# EAGLE design M405B (EAGLE 6.6.0)
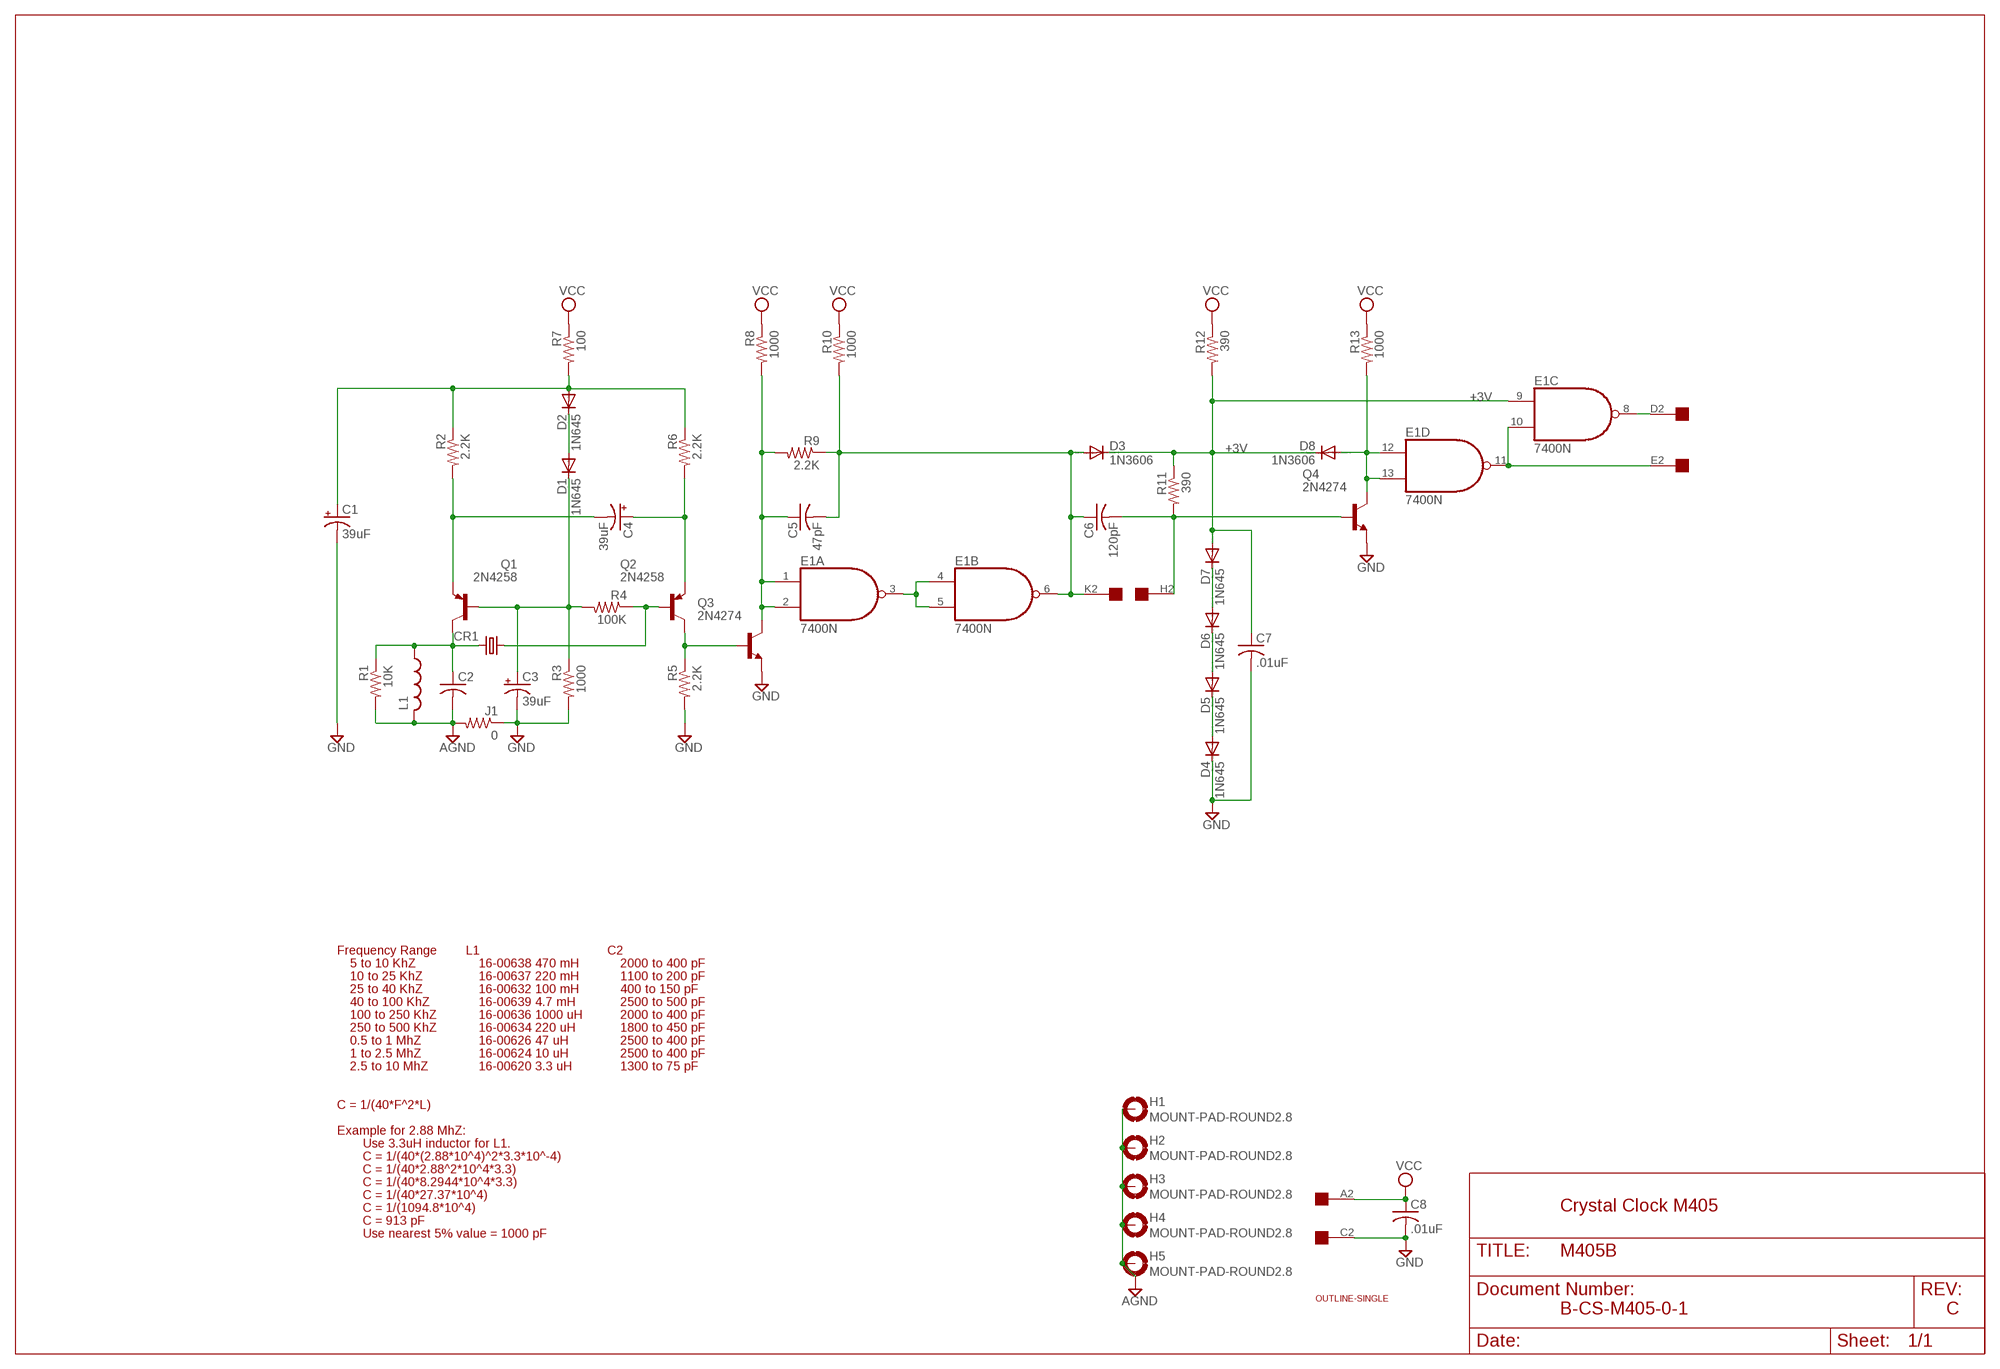
[diagram p0: schematic, sheet 1]

## Parts
C1  39uF  CPOL-USE15-5AXIAL  [E15-5]
C2  C-US150-054X183  [C150-054X183]
C3  39uF  CPOL-USE15-5AXIAL  [E15-5]
C4  39uF  CPOL-USE15-5AXIAL  [E15-5]
C5  47pF  C-US050-025X075  [C050-025X075]
C6  120pF  C-US050-025X075  [C050-025X075]
C7  .01uF  C-US050-025X075  [C050-025X075]
C8  .01uF  C-US050-025X075  [C050-025X075]
CR1  CRYSTALHC13U-H  [HC13U-H]
D1  1N645  1N4148DO35-10  [DO35-10]
D2  1N645  1N4148DO35-10  [DO35-10]
D3  1N3606  1N4148DO35-10  [DO35-10]
D4  1N645  1N4148DO35-10  [DO35-10]
D5  1N645  1N4148DO35-10  [DO35-10]
D6  1N645  1N4148DO35-10  [DO35-10]
D7  1N645  1N4148DO35-10  [DO35-10]
D8  1N3606  1N4148DO35-10  [DO35-10]
E1  7400N  [DIL14]
H1  MOUNT-PAD-ROUND2.8  [2,8-PAD]
H2  MOUNT-PAD-ROUND2.8  [2,8-PAD]
H3  MOUNT-PAD-ROUND2.8  [2,8-PAD]
H4  MOUNT-PAD-ROUND2.8  [2,8-PAD]
H5  MOUNT-PAD-ROUND2.8  [2,8-PAD]
J1  0  R-US_0207/10  [0207/10]
L1  L-US0207/12  [0207/12]
Q1  2N4258  2N3637-PNP-TO39-EBC  [TO39]
Q2  2N4258  2N3637-PNP-TO39-EBC  [TO39]
Q3  2N4274  2N3019-NPN-TO39-EBC  [TO39]
Q4  2N4274  2N3019-NPN-TO39-EBC  [TO39]
R1  10K  R-US_0207/10  [0207/10]
R2  2.2K  R-US_0207/10  [0207/10]
R3  1000  R-US_0207/10  [0207/10]
R4  100K  R-US_0207/10  [0207/10]
R5  2.2K  R-US_0207/10  [0207/10]
R6  2.2K  R-US_0207/10  [0207/10]
R7  100  R-US_0207/10  [0207/10]
R8  1000  R-US_0207/10  [0207/10]
R9  2.2K  R-US_0207/10  [0207/10]
R10  1000  R-US_0207/10  [0207/10]
R11  390  R-US_0207/10  [0207/10]
R12  390  R-US_0207/10  [0207/10]
R13  1000  R-US_0207/10  [0207/10]
U$1  OUTLINE-SINGLE  [SINGLE]
U$2  EDGE-1  [EDGE-CON1]

## Nets
+3V: C7.1 D3.C D7.A D8.C E1.9(C:I0) R11.1 R12.2
AGND [power]: C2.2 H1.B2,8(MOUNT) H2.B2,8(MOUNT) H3.B2,8(MOUNT) H4.B2,8(MOUNT) H5.B2,8(MOUNT) J1.2 L1.2 R1.2
GND [power]: C1.- C3.- C7.2 C8.2 D4.C J1.1 Q3.1(E) Q4.1(E) R3.2 R5.2 U$2.C2
N$1: CR1.1 Q2.2(B) R4.1
N$2: C4.- Q1.1(E) R2.2
N$3: C3.+ D1.C Q1.2(B) R3.1 R4.2
N$4: E1.8(C:O) U$2.D2
N$5: C2.1 CR1.2 L1.1 Q1.3(C) R1.1
N$6: D1.A D2.C
N$7: E1.10(C:I1) E1.11(D:O) U$2.E2
N$8: C4.+ Q2.1(E) R6.2
N$9 [power]: C1.+ D2.A R2.1 R6.1 R7.2
N$10: Q2.3(C) Q3.2(B) R5.1
N$11: C5.1 E1.1(A:I0) E1.2(A:I1) Q3.3(C) R8.2 R9.2
N$12: D8.A E1.12(D:I0) E1.13(D:I1) Q4.3(C) R13.2
N$13: C5.2 C6.1 D3.A E1.6(B:O) R9.1 R10.2 U$2.K2
N$14: E1.3(A:O) E1.4(B:I0) E1.5(B:I1)
N$15: D6.A D7.C
N$16: C6.2 Q4.2(B) R11.2 U$2.H2
N$18: D5.A D6.C
N$19: D4.A D5.C
VCC [power]: C8.1 R7.1 R8.1 R10.1 R12.1 R13.1 U$2.A2
Unconnected: U$2.B2 U$2.F2 U$2.J2 U$2.L2 U$2.M2 U$2.N2 U$2.P2 U$2.R2 U$2.S2 U$2.T2 U$2.U2 U$2.V2

## Notes on the sheet
- Frequency Range | L1 | C2
- 5 to 10 KhZ | 16-00638 470 mH | 2000 to 400 pF
- 10 to 25 KhZ | 16-00637 220 mH | 1100 to 200 pF
- 25 to 40 KhZ | 16-00632 100 mH | 400 to 150 pF
- 40 to 100 KhZ | 16-00639 4.7 mH | 2500 to 500 pF
- 100 to 250 KhZ | 16-00636 1000 uH | 2000 to 400 pF
- 250 to 500 KhZ | 16-00634 220 uH | 1800 to 450 pF
- 0.5 to 1 MhZ | 16-00626 47 uH | 2500 to 400 pF
- 1 to 2.5 MhZ | 16-00624 10 uH | 2500 to 400 pF
- 2.5 to 10 MhZ | 16-00620 3.3 uH | 1300 to 75 pF
- C = 1/(40*F^2*L)
- Example for 2.88 MhZ:
- Use 3.3uH inductor for L1.
- C = 1/(40*(2.88*10^4)^2*3.3*10^-4)
- C = 1/(40*2.88^2*10^4*3.3)
- C = 1/(40*8.2944*10^4*3.3)
- C = 1/(40*27.37*10^4)
- C = 1/(1094.8*10^4) | Crystal Clock M405
- C = 913 pF
- Use nearest 5% value = 1000 pF
- B-CS-M405-0-1 | C

## Power pins joined to a net without a drawn wire
GND: E1.7(P:GND)
VCC: E1.14(P:VCC)

## Library data of the parts
C1 C3 C4 = rcl:CPOL-US: POLARIZED CAPACITOR, American symbol
C2 C5-C8 = rcl:C-US: CAPACITOR, American symbol
CR1 = crystal:CRYSTAL: CRYSTAL; OC_FARNELL: unknown; OC_NEWARK: unknown
D1-D8 = diode:1N4148: DIODE high speed (Philips)
E1 = 74xx-us:74*00: Quad 2-input NAND gate
H1-H5 = holes:MOUNT-PAD-ROUND: MOUNTING PAD, round
J1 R1-R13 = rcl:R-US_: RESISTOR, American symbol
L1 = rcl:L-US: INDUCTOR, American symbol
Q1 Q2 = transistor:*-PNP-: PNP Transistror
Q3 Q4 = transistor:*-NPN-: NPN Transistror BF959 corrected 2008.03.06
U$1 = dec-con:OUTLINE-*: Board outlines for DEC boards.
U$2 = dec-con:EDGE-1: Single-Sided DEC Edge Connector -- (side 2)

## Net classes
1 power: width 0.813 mm

## Board
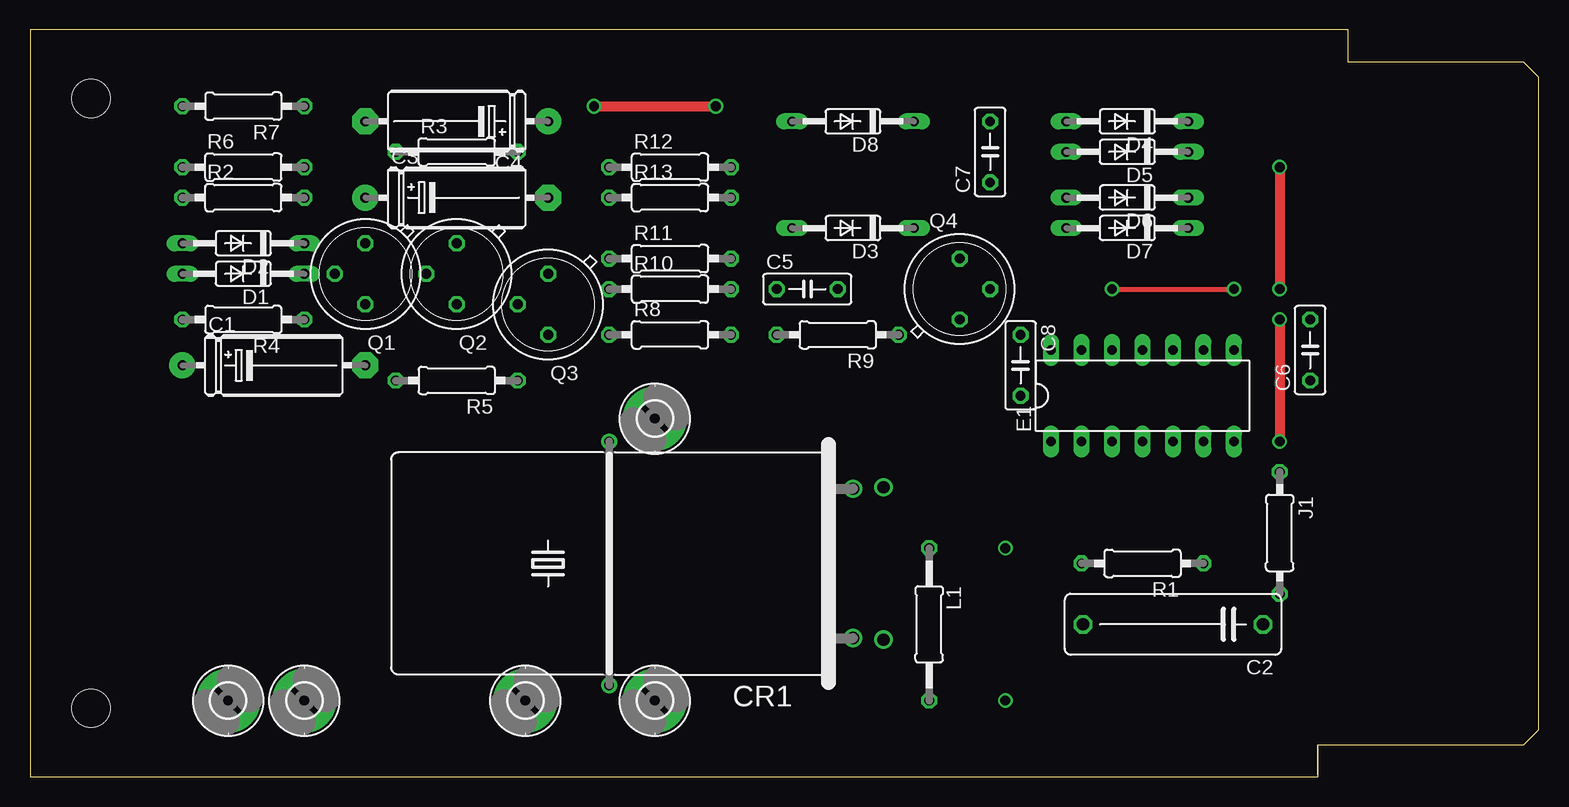
[diagram p1: board, top side]
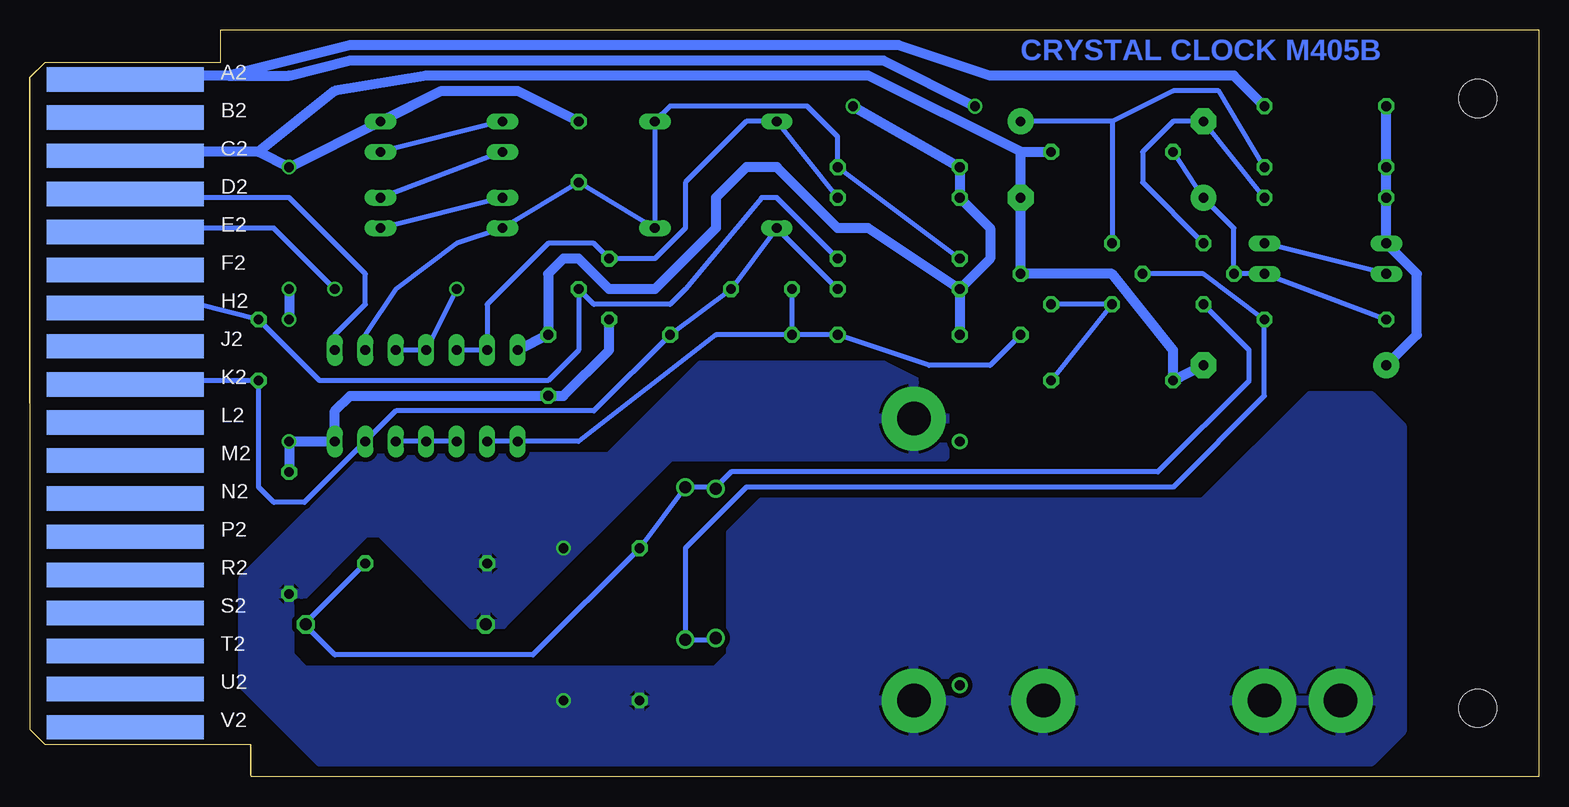
[diagram p2: board, bottom side, seen from below]

Size 125.73 x 62.23 mm. Coordinates in mm from the lower left corner, seen from the top.
Copper layers (1+16): Top 0.035mm / dielectric 1.5mm / Bottom 0.035mm
Design rules "16mils": minimum track width 16mil, minimum drill 32mil, track to track 15mil, track to pad 10mil, pad to pad 10mil, via to via 10mil, smd to smd 10mil, copper to edge 13mil, drill to drill 10mil, minimum pad ring 10mil, minimum via ring 8mil, stop-mask expansion 0mil, vias tented up to drill 0mil, thermal gap 10mil

### Footprints (pad centres in the part's own frame; a part is rotated, then mirrored left to right if it is on the bottom)
E15-5 = drill 0.813 pad 2.159: + -7.62,0 | drill 0.813 pad 2.159 octagon: - 7.62,0
C150-054X183 = drill 1.016 octagon: 1 -7.493,0; 2 7.493,0
C050-025X075 = drill 0.813 octagon: 1 -2.54,0; 2 2.54,0
HC13U-H = drill 1.016: 1 -6.223,-5.08; 2 6.223,-5.08 | drill 0.813: M -10.16,15.24; M1 10.16,15.24
DO35-10 = drill 0.813 long: A 5.08,0; C -5.08,0
DIL14 = drill 0.813 long: 1 -7.62,-3.81; 2 -5.08,-3.81; 3 -2.54,-3.81; 4 0,-3.81; 5 2.54,-3.81; 6 5.08,-3.81; 7 7.62,-3.81; 8 7.62,3.81; 9 5.08,3.81; 10 2.54,3.81; 11 0,3.81; 12 -2.54,3.81; 13 -5.08,3.81; 14 -7.62,3.81
2,8-PAD = drill 2.8 pad 5.334: B2,8 0,0
0207/10 = drill 0.813 octagon: 1 -5.08,0; 2 5.08,0
0207/12 = drill 0.813 octagon: 1 -6.35,0; 2 6.35,0
TO39 = drill 0.813 octagon: 1 0,-2.54; 2 2.54,0; 3 0,2.54
SINGLE = hole 3.175: 120.65,56.515; 120.65,5.715
EDGE-CON1 = smd 13.106 x 2.032 bottom: A2 7.938,4.128; B2 7.938,7.303; C2 7.938,10.477; D2 7.938,13.652; E2 7.938,16.828; F2 7.938,20.003; H2 7.938,23.177; J2 7.938,26.352; K2 7.938,29.527; L2 7.938,32.703; M2 7.938,35.877; N2 7.938,39.053; P2 7.938,42.227; R2 7.938,45.403; S2 7.938,48.578; T2 7.938,51.752; U2 7.938,54.928; V2 7.938,58.102

### Placement (x,y rotation side)
C1  20.32,34.29 0 top
C2  95.25,12.7 180 top
C3  35.56,48.26 0 top
C4  35.56,54.61 180 top
C5  64.77,40.64 0 top
C6  106.68,35.56 90 top
C7  80.01,52.07 90 top
C8  82.55,34.29 270 top
CR1  63.5,17.78 90 top
D1  17.78,41.91 180 top
D2  17.78,44.45 180 top
D3  68.58,45.72 180 top
D4  91.44,54.61 180 top
D5  91.44,52.07 180 top
D6  91.44,48.26 180 top
D7  91.44,45.72 180 top
D8  68.58,54.61 180 top
E1  92.71,31.75 0 top
H1  16.51,6.35 0 top
H2  22.86,6.35 0 top
H3  52.07,6.35 0 top
H4  41.27,6.35 0 top
H5  52.07,29.84 0 top
J1  104.14,20.32 270 top
L1  74.93,12.7 270 top
Q1  27.94,41.91 180 top
Q2  35.56,41.91 180 top
Q3  43.18,39.37 180 top
Q4  77.47,40.64 0 top
R1  92.71,17.78 180 top
R2  17.78,48.26 0 top
R3  35.56,52.07 0 top
R4  17.78,38.1 180 top
R5  35.56,33.02 180 top
R6  17.78,50.8 0 top
R7  17.78,55.88 180 top
R8  53.34,36.83 0 top
R9  67.31,36.83 180 top
R10  53.34,40.64 0 top
R11  53.34,43.18 0 top
R12  53.34,50.8 0 top
R13  53.34,48.26 0 top
U$1  125.73,62.23 180 top
U$2  125.73,62.23 180 top

### Tracks (layer width: path | path; a pad name or v marks a point on that pad's centre or on a via)
+3V
  Bottom 0.406: E1.9 97.79,36.83 95.25,40.64 90.17,44.45 D7.A C7.1 D3.C D8.C 72.39,55.88 60.96,55.88 58.42,53.34 R12.2 R11.1
AGND  (via drill 0.81)
  other vias: 81.28,19.05 81.28,6.35
  pour Bottom: 13.97,31.75 11.43,29.21 11.43,3.81 13.97,1.27 101.6,1.27 107.95,7.62 107.95,16.51 97.79,26.67 77.47,26.67 69.85,34.29 54.61,34.29 49.53,31.75 49.53,26.67 72.39,26.67 86.36,12.7 88.9,12.7 96.52,20.32 97.79,20.32 104.14,13.97 104.14,10.16 102.87,8.89 68.58,8.89 67.31,10.16 67.31,20.32 64.77,22.86 27.94,22.86 19.05,31.75
GND  (via drill 0.81)
  Top 0.813: v104.14,50.8 v104.14,40.64 | v104.14,38.1 v104.14,27.94
  Bottom 0.813: 43.18,52.07 C3.- Q3.1 35.56,41.91 30.48,35.56 R5.2 C1.- | U$2.C2 116.84,52.07 106.68,52.07 | 106.68,52.07 v104.14,50.8 D4.C 91.44,57.15 85.09,57.15 C7.2 | 43.18,52.07 R3.2 | 43.18,52.07 55.88,58.42 92.71,58.42 100.33,57.15 106.68,52.07 | Q4.1 77.47,35.56 81.28,31.75 C8.2 99.06,31.75 100.33,30.48 E1.7 v104.14,27.94 J1.1 | v104.14,40.64 v104.14,38.1
N$1  (via drill 1.02)
  Bottom 0.406: CR1.1 68.58,11.43 v71.12,11.43 71.12,19.05 66.04,24.13 30.48,24.13 22.86,31.75 R4.1 27.94,41.91 Q2.2
N$2
  Bottom 0.406: R2.2 C4.- 30.48,54.61 33.02,52.07 33.02,49.53 Q1.1
N$3
  Bottom 0.406: R4.2 D1.C Q1.2 25.4,45.72 C3.+ R3.1
N$4
  Bottom 0.406: U$2.D2 116.84,48.26 104.14,48.26 97.79,41.91 97.79,39.37 100.33,36.83 E1.8
N$5  (via drill 1.02)
  Bottom 0.406: 68.58,24.13 CR1.2 | 68.58,24.13 v71.12,24.13 L1.1 83.82,10.16 100.33,10.16 102.87,12.7 | 68.58,24.13 67.31,25.4 31.75,25.4 24.13,33.02 24.13,35.56 Q1.3 | 102.87,12.7 C2.1 | 102.87,12.7 R1.1
N$6
  Bottom 0.406: D1.A D2.C
N$7  (via drill 0.81)
  Top 0.406: v90.17,40.64 v100.33,40.64
  Bottom 0.406: E1.11 E1.10 E1.11 | E1.11 v90.17,40.64 | U$2.E2 116.84,45.72 105.41,45.72 v100.33,40.64
N$8
  Bottom 0.406: 35.56,54.61 C4.+ | 35.56,54.61 Q2.1 | R6.2 26.67,57.15 30.48,57.15 35.56,54.61
N$9
  Bottom 0.813: R7.2 R6.1 R2.1 D2.A 10.16,41.91 10.16,36.83 C1.+
N$10
  Bottom 0.406: Q3.2 Q2.3 R5.1
N$11
  Bottom 0.406: Q3.3 45.72,34.29 50.8,34.29 R8.2 R9.2 | R9.2 C5.1 | E1.2 E1.1 80.01,27.94 68.58,36.83 R9.2
N$12
  Bottom 0.406: E1.12 E1.13 87.63,39.37 82.55,44.45 78.74,44.45 Q4.3 73.66,43.18 71.12,45.72 71.12,49.53 66.04,54.61 D8.A R13.2
N$13
  Bottom 0.406: R10.2 D3.A C5.2 R9.1 78.74,30.48 95.25,30.48 E1.6 102.87,22.86 105.41,22.86 106.68,24.13 C6.1 116.84,33.02 U$2.K2
N$14
  Bottom 0.406: E1.3 E1.4 E1.5
N$15
  Bottom 0.406: D6.A D7.C
N$16
  Bottom 0.406: U$2.H2 116.84,39.37 111.76,39.37 C6.2 101.6,33.02 82.55,33.02 80.01,35.56 Q4.2 78.74,39.37 72.39,39.37 71.12,40.64 64.77,48.26 63.5,48.26 R11.2
N$18
  Bottom 0.406: D5.A D6.C
N$19
  Bottom 0.406: D4.A D5.C
VCC  (via drill 0.81)
  Top 0.813: v46.99,55.88 v57.15,55.88
  Bottom 0.813: R10.1 R8.1 | R10.1 45.72,43.18 45.72,45.72 R13.1 R12.1 v57.15,55.88 | R7.1 25.4,58.42 45.72,58.42 53.34,60.96 99.06,60.96 109.22,58.42 | U$2.A2 116.84,58.42 109.22,58.42 | E1.14 C8.1 82.55,41.91 81.28,43.18 80.01,43.18 77.47,40.64 73.66,40.64 68.58,45.72 68.58,48.26 66.04,50.8 63.5,50.8 58.42,45.72 55.88,45.72 R10.1 | v46.99,55.88 54.61,59.69 99.06,59.69 104.14,58.42 109.22,58.42

### Text on the board
Bottom: CRYSTAL CLOCK M405B